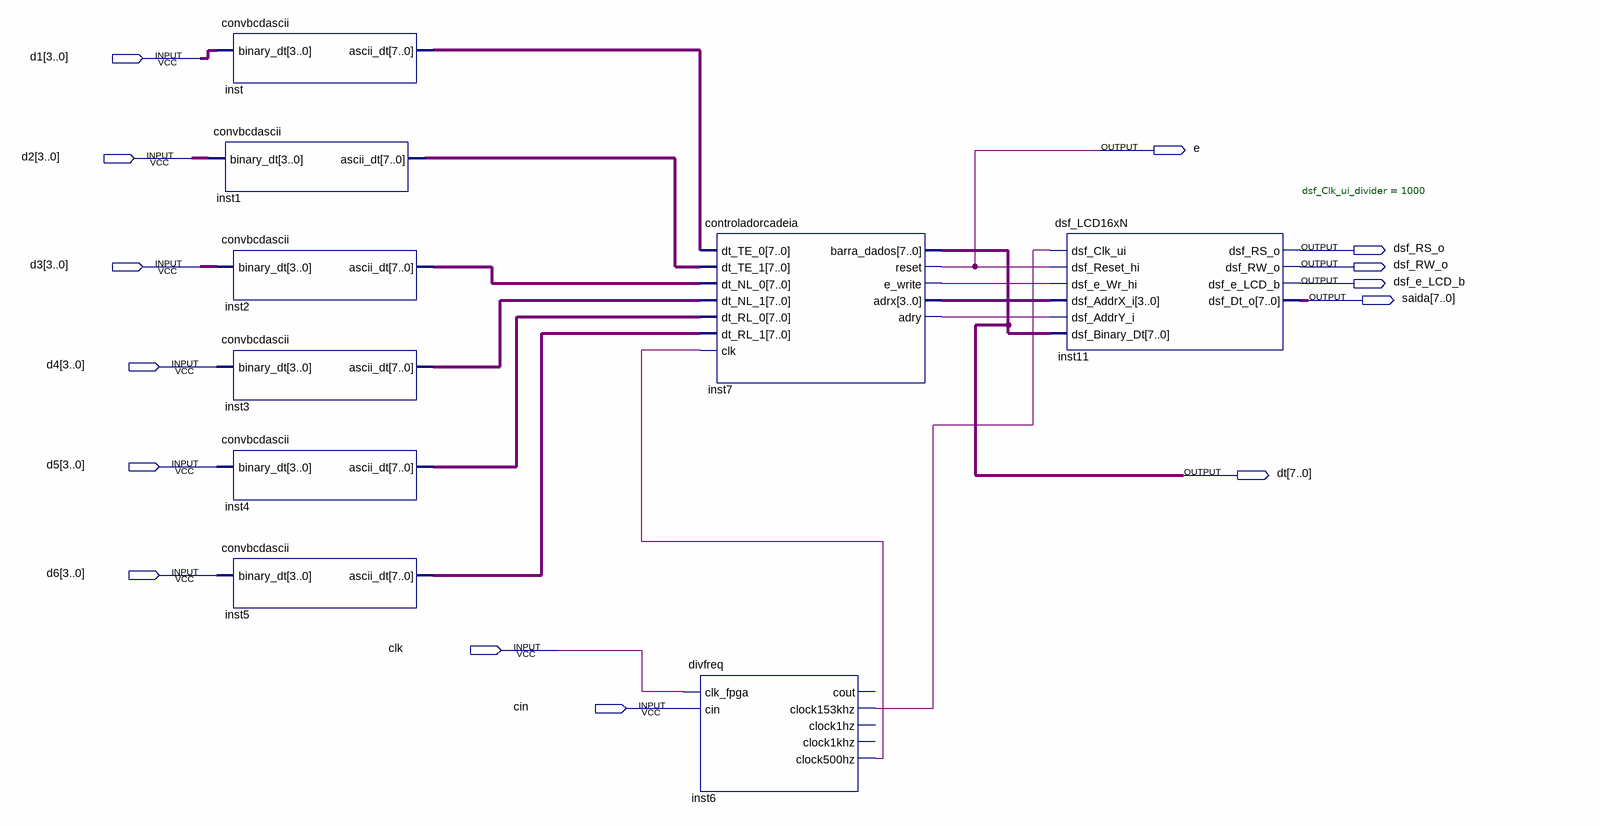
[diagram p0: schematic sheet]
// Quartus schematic COMPLETA.bdf as structural Verilog: 9 symbols, 14 pins
module COMPLETA (
  input  [3:0] d1,
  input  [3:0] d2,
  input  [3:0] d3,
  input  [3:0] d4,
  input  [3:0] d5,
  input  [3:0] d6,
  input  clk,
  input  cin,
  output e,
  output dsf_RS_o,
  output dsf_RW_o,
  output dsf_e_LCD_b,
  output [7:0] saida,
  output [7:0] dt
);

  wire inst6_clock153khz, inst6_clock500hz, inst7_adry, inst7_e_write;
  wire [3:0] inst7_adrx;
  wire [7:0] inst1_ascii_dt, inst2_ascii_dt, inst3_ascii_dt, inst4_ascii_dt, inst5_ascii_dt, inst_ascii_dt;

  convbcdascii inst (.binary_dt(d1), .ascii_dt(inst_ascii_dt));
  convbcdascii inst1 (.binary_dt(d2), .ascii_dt(inst1_ascii_dt));
  convbcdascii inst2 (.binary_dt(d3), .ascii_dt(inst2_ascii_dt));
  convbcdascii inst3 (.binary_dt(d4), .ascii_dt(inst3_ascii_dt));
  convbcdascii inst4 (.binary_dt(d5), .ascii_dt(inst4_ascii_dt));
  convbcdascii inst5 (.binary_dt(d6), .ascii_dt(inst5_ascii_dt));
  controladorcadeia inst7 (
    .dt_TE_0(inst_ascii_dt), .dt_TE_1(inst1_ascii_dt), .dt_NL_0(inst2_ascii_dt), .dt_NL_1(inst3_ascii_dt),
    .dt_RL_0(inst4_ascii_dt), .dt_RL_1(inst5_ascii_dt), .clk(inst6_clock500hz), .barra_dados(dt), .reset(e),
    .e_write(inst7_e_write), .adrx(inst7_adrx), .adry(inst7_adry));
  divfreq inst6 (
    .clk_fpga(clk), .cin(cin), .clock153khz(inst6_clock153khz), .clock500hz(inst6_clock500hz));  // open: cout, clock1hz, clock1khz
  dsf_LCD16xN #(.dsf_Clk_ui_divider(1000)) inst11 (
    .dsf_Clk_ui(inst6_clock153khz), .dsf_Reset_hi(e), .dsf_e_Wr_hi(inst7_e_write), .dsf_AddrX_i(inst7_adrx),
    .dsf_AddrY_i(inst7_adry), .dsf_Binary_Dt(dt), .dsf_RS_o(dsf_RS_o), .dsf_RW_o(dsf_RW_o),
    .dsf_e_LCD_b(dsf_e_LCD_b), .dsf_Dt_o(saida));
endmodule
